# Altium project AVR Development Main board.PrjPcb
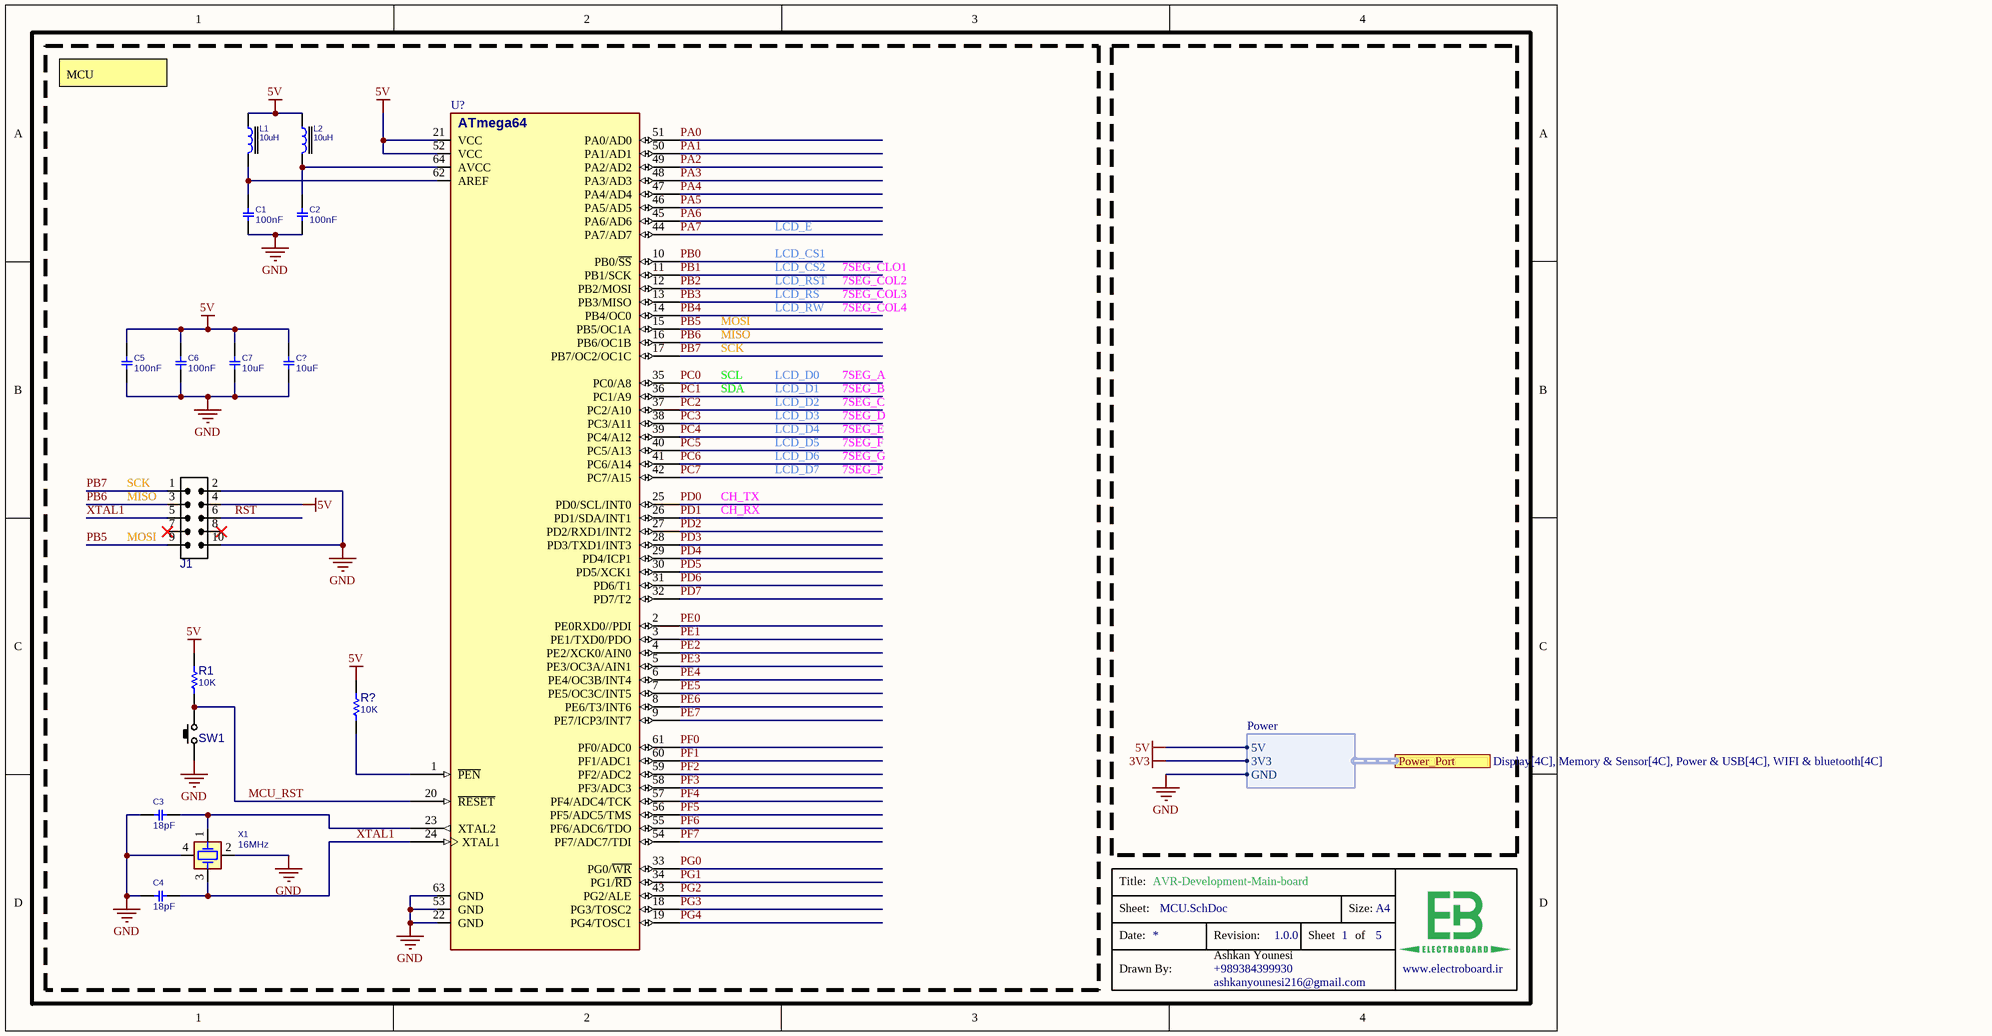
[diagram p0: MCU.SchDoc]
Revision: 1.0.0; Title: AVR-Development-Main-board
5 sheets, 172 parts. Net scope: flat (ports and power ports of the same name join across sheets).
Sheets:
  MCU.SchDoc
  Memory & Sensor.SchDoc
  WIFI & bluetooth.SchDoc
  Display.SchDoc
  Power & USB.SchDoc

## Sheet MCU.SchDoc: AVR-Development-Main-board
size A4; SheetNumber: 1; SheetTotal: 5

### Parts
(Parts that share a designator on the sheet are numbered #1, #2 ... from top to bottom, then left to right.)
C1  100nF  [C0805]
C2  100nF  [C0805]
C3  18pF  [C0805]
C4  18pF  [C0805]
C5  100nF  [C0805]
C6  100nF  [C0805]
C7  10uF  [C0805]
C?#1  10uF  [C0805]
J1  IDC_2X5  [IDC_2X5]  (value not drawn)
L1  10uH  [L0805]
L2  10uH  [L0805]
R1  10K  [R0805]
R?#1  10K  [R0805]
SW1  PUSHBUTTON  [SWPBS_SPST_6X3X5]  (value not drawn)
U?#1  ATMEGA64  [QFG80_64]  (value not drawn)
X1  16MHz  [XTL_4_3225]

### Ports
Power_Port (harness POWER, see Display[4C], Memory & Sensor[4C], Power & USB[4C], WIFI & bluetooth[4C])

### Harnesses
Power: 5V, 3V3, GND

### Nets
5V: C5.2 C6.2 C7.2 C?#1.2 J1.4 L1.1 L2.1 R1.1 R?#1.1 U?#1.21(VCC) U?#1.52(VCC) ; port Power_Port.5V
GND: C1.1 C2.1 C3.2 C4.1 C5.1 C6.1 C7.1 C?#1.1 J1.2 J1.10 SW1.1(P1) U?#1.22(GND) U?#1.53(GND) U?#1.63(GND) X1.2 X1.4 ; port Power_Port.GND
MCU_RST: R1.2 SW1.2(P3) U?#1.20(~{RESET})
PA0: U?#1.51(PA0/AD0)
PA1: U?#1.50(PA1/AD1)
PA2: U?#1.49(PA2/AD2)
PA3: U?#1.48(PA3/AD3)
PA4: U?#1.47(PA4/AD4)
PA5: U?#1.46(PA5/AD5)
PA6: U?#1.45(PA6/AD6)
PA7: U?#1.44(PA7/AD7)
PB0: U?#1.10(PB0/~{SS})
PB1: U?#1.11(PB1/SCK)
PB2: U?#1.12(PB2/MOSI)
PB3: U?#1.13(PB3/MISO)
PB4: U?#1.14(PB4/OC0)
PB5: J1.9 U?#1.15(PB5/OC1A)
PB6: J1.3 U?#1.16(PB6/OC1B)
PB7: J1.1 U?#1.17(PB7/OC2/OC1C)
PC0: U?#1.35(PC0/A8)
PC1: U?#1.36(PC1/A9)
PC2: U?#1.37(PC2/A10)
PC3: U?#1.38(PC3/A11)
PC4: U?#1.39(PC4/A12)
PC5: U?#1.40(PC5/A13)
PC6: U?#1.41(PC6/A14)
PC7: U?#1.42(PC7/A15)
PD0: U?#1.25(PD0/SCL/INT0)
PD1: U?#1.26(PD1/SDA/INT1)
PD2: U?#1.27(PD2/RXD1/INT2)
PD3: U?#1.28(PD3/TXD1/INT3)
PD4: U?#1.29(PD4/ICP1)
PD5: U?#1.30(PD5/XCK1)
PD6: U?#1.31(PD6/T1)
PD7: U?#1.32(PD7/T2)
PE0: U?#1.2(PE0RXD0//PDI)
PE1: U?#1.3(PE1/TXD0/PDO)
PE2: U?#1.4(PE2/XCK0/AIN0)
PE3: U?#1.5(PE3/OC3A/AIN1)
PE4: U?#1.6(PE4/OC3B/INT4)
PE5: U?#1.7(PE5/OC3C/INT5)
PE6: U?#1.8(PE6/T3/INT6)
PE7: U?#1.9(PE7/ICP3/INT7)
PF0: U?#1.61(PF0/ADC0)
PF1: U?#1.60(PF1/ADC1)
PF2: U?#1.59(PF2/ADC2)
PF3: U?#1.58(PF3/ADC3)
PF4: U?#1.57(PF4/ADC4/TCK)
PF5: U?#1.56(PF5/ADC5/TMS)
PF6: U?#1.55(PF6/ADC6/TDO)
PF7: U?#1.54(PF7/ADC7/TDI)
PG0: U?#1.33(PG0/~{WR})
PG1: U?#1.34(PG1/~{RD})
PG2: U?#1.43(PG2/ALE)
PG3: U?#1.18(PG3/TOSC2)
PG4: U?#1.19(PG4/TOSC1)
RST: J1.6
XTAL1: C4.2 J1.5 U?#1.24(XTAL1) X1.3
NetC1_2: C1.2 L1.2 U?#1.62(AREF)
NetC2_2: C2.2 L2.2 U?#1.64(AVCC)
NetC3_1: C3.1 U?#1.23(XTAL2) X1.1
NetR?#1_2: R?#1.2 U?#1.1(~{PEN})

Not connected (* = marked no-connect by the designer): J1 7* 8*

### Notes on the sheet
- MCU
- LCD_E
- LCD_RW
- LCD_RS
- LCD_RST
- LCD_CS2
- LCD_CS1
- 7SEG_CLO1
- 7SEG_COL2
- 7SEG_COL3
- 7SEG_COL4
- SCK
- MISO
- MOSI
- SCL
- LCD_D0
- 7SEG_A
- SDA
- LCD_D5
- LCD_D4
- LCD_D3
- LCD_D2
- LCD_D1
- 7SEG_B
- 7SEG_C
- 7SEG_D
- 7SEG_E
- 7SEG_F
- (near J1) SCK
- (near J1) MISO
- CH_TX
- CH_RX
- LCD_D7
- LCD_D6
- 7SEG_G
- 7SEG_P
- (near J1) MOSI
- Title:
- Sheet:
- Size:
- A4
- Drawn By:
- Date:
- Revision:
- Ashkan Younesi
- ashkanyounesi216@gmail.com
- +989384399930
- Sheet
- of
- www.electroboard.ir <http://www.electroboard.ir>
- (in symbol ATMEGA64A_QFP64) ATmega64

### Library data of the parts
C1-C7 C?#1 = CAP_SMD_MLCC_0805: CAP, MLCC; PARAM: -, -%; MANF_P#: MANF_PART#; PARAM2: -V; PRICE: 100= 1$; MANF: -; ASSEMBLY: ASSEMBLY
  C1 C2 C5 C6: VALUE: 100nF
  C3 C4: VALUE: 18pF
  C7 C?#1: VALUE: 10uF
J1 = IDC_2X5: CONN, IDC, Male, pitch: 2.54mm, 10POS; VALUE: IDC_2X5
L1 L2 = IND_SMD_470nH_3.2A: INDUCTOR, 470nH, 3.2A (Irms), 36mOhm; PARAM: 3.2A (Irms), -55~155oC; MANF: Taiyo Yuden; PARAM2: 36mOhm, 0.8mm Height; MANF_P#: MCHK2012TR47M; PRICE: 0.25$; ASSEMBLY: ASSEMBLY; VALUE: 10uH
R1 R?#1 = RES_SMD_0805: RESISTOR, SMD; PARAM: -W; DESC: DESCRIPTION; DIST#: MOUSER; PARAM2: 1%; MANF_P#: -; MANF: -; ASSEMBLY: ASSEMBLY; PRICE: 100= 0.5$; VALUE: 10K
SW1 = SWPBS_SPST_6X3X5: SWITCH, PUSH BUTTON, TACTILE, SMD, SPST, 6X3.5X5mm; MANF: ALPS; DESC: DESCRIPTION; MANF_P#: SKQMBBE010; VALUE: PUSHBUTTON; ASSEMBLY: ASSEMBLY; PARAM: PARAM; PRICE: PRICE
U?#1 = ATMEGA64A_QFP64: MCU, AVR, 8-Bit, 64KB, 4KB RAM, 16MHz; MANF_P#: ATMEGA64A-AU; DESC: 2KB EEPROM; MANF: ATMEL/MICROCHIP; PARAM2: 2.7~5.5V; PARAM: 64KB, 4KB RAM, 16MHz, -40~85°C; PRICE: 4.5$; VALUE: ATMEGA64
X1 = XTL_4_12MHz_3225: Crystal 12MHz; MANF: ECS; MANF_P#: ECS-120-18-33-JEM-TR; PARAM: 20PPM, 18pF; PRICE: 0.5$; VALUE: 16MHz

## Sheet Memory & Sensor.SchDoc: AVR-Development-Main-board
size A4; SheetNumber: 2; SheetTotal: 4
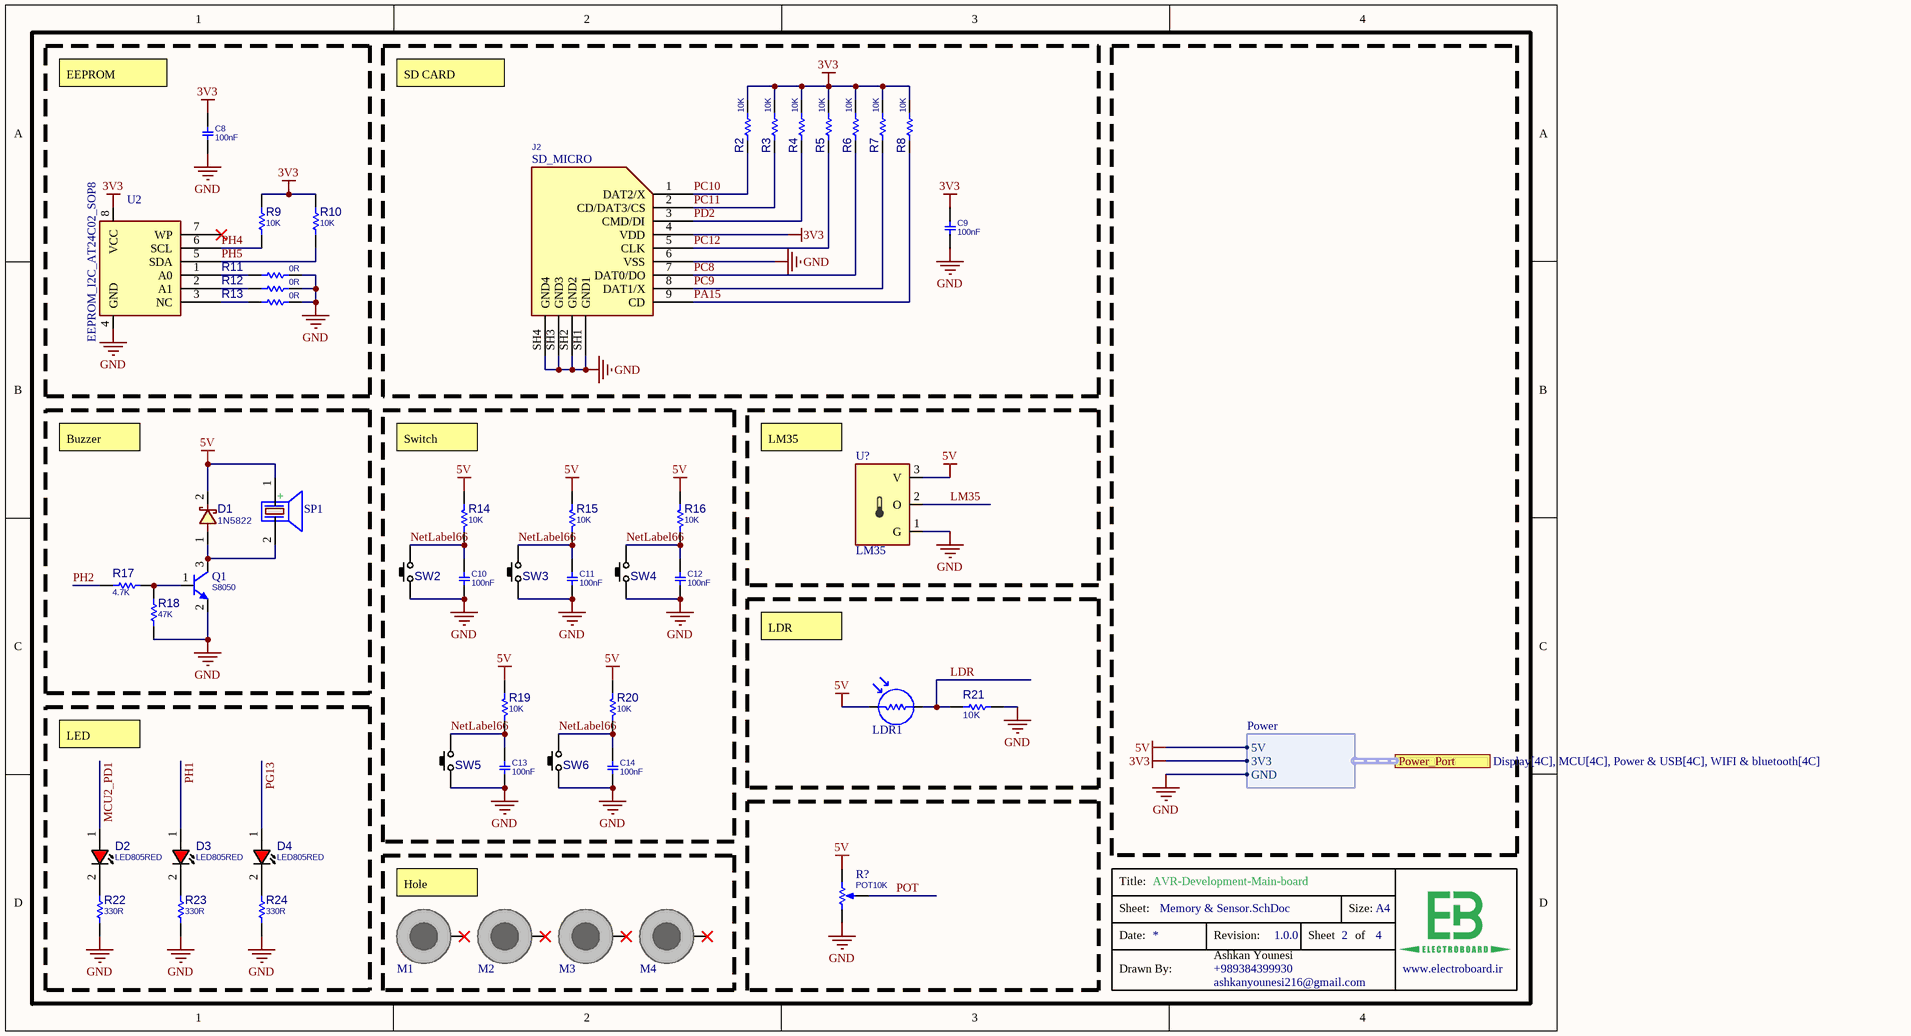
[diagram p1: Memory & Sensor.SchDoc]

### Parts
(Parts that share a designator on the sheet are numbered #1, #2 ... from top to bottom, then left to right.)
C8  100nF  [C0603]
C9  100nF  [C0603]
C10  100nF  [C0603]
C11  100nF  [C0603]
C12  100nF  [C0603]
C13  100nF  [C0603]
C14  100nF  [C0603]
D1  1N5822  [D_SMA]
D2  LED805RED  [LED0805RED]
D3  LED805RED  [LED0805RED]
D4  LED805RED  [LED0805RED]
J2  SD_MICRO  [SDMICRO_AT]
LDR1  PhotoCell  [PhotoCell]  (value not drawn)
M1  DNP/MH  [SCMH_M3F]  (value not drawn)  (no BOM)
M2  DNP/MH  [SCMH_M3F]  (value not drawn)  (no BOM)
M3  DNP/MH  [SCMH_M3F]  (value not drawn)  (no BOM)
M4  DNP/MH  [SCMH_M3F]  (value not drawn)  (no BOM)
Q1  S8050  [SOT23_3]
R2  10K  [R0603]
R3  10K  [R0603]
R4  10K  [R0603]
R5  10K  [R0603]
R6  10K  [R0603]
R7  10K  [R0603]
R8  10K  [R0603]
R9  10K  [R0603]
R10  10K  [R0603]
R11  0R  [R0603]
R12  0R  [R0603]
R13  0R  [R0603]
R14  10K  [R0603]
R15  10K  [R0603]
R16  10K  [R0603]
R17  4.7K  [R0603]
R18  47K  [R0603]
R19  10K  [R0603]
R20  10K  [R0603]
R21  10K  [R0805]
R22  330R  [R0603]
R23  330R  [R0603]
R24  330R  [R0603]
R?#2  POT10K  [POT_3296W]
SP1  (no value)  [BUZZER 7.62mm DC]
SW2  PUSHBUTTON  [SWPBS_SPST_6X3X5]  (value not drawn)
SW3  PUSHBUTTON  [SWPBS_SPST_6X3X5]  (value not drawn)
SW4  PUSHBUTTON  [SWPBS_SPST_6X3X5]  (value not drawn)
SW5  PUSHBUTTON  [SWPBS_SPST_6X3X5]  (value not drawn)
SW6  PUSHBUTTON  [SWPBS_SPST_6X3X5]  (value not drawn)
U2  EEPROM_I2C_AT24C02_SOP8  [SO_8]
U?#2  LM35  [TO92_3]

### Ports
Power_Port (harness POWER, see Display[4C], MCU[4C], Power & USB[4C], WIFI & bluetooth[4C])

### Harnesses
Power: 5V, 3V3, GND

### Nets
3V3: C8.2 C9.1 J2.4(VDD) R2.2 R3.2 R4.2 R5.2 R6.2 R7.2 R8.2 R9.2 R10.2 U2.8(VCC) ; port Power_Port.3V3
5V: D1.2 LDR1.1 R14.2 R15.2 R16.2 R19.2 R20.2 R?#2.3(BOT) SP1.1(+) U?#2.3(V) ; port Power_Port.5V
GND: C8.1 C9.2 C10.1 C11.1 C12.1 C13.1 C14.1 J2.6(VSS) J2.SH1(GND1) J2.SH2(GND2) J2.SH3(GND3) J2.SH4(GND4) Q1.2(E) R11.2 R12.2 R13.2 R18.1 R21.1 R22.1 R23.1 R24.1 R?#2.1(TOP) SW2.2(P3) SW3.2(P3) SW4.2(P3) SW5.2(P3) SW6.2(P3) U2.4(GND) U?#2.1(G) ; port Power_Port.GND
LDR: LDR1.2 R21.2
LM35: U?#2.2(O)
MCU2_PD1: D2.1(ANODE)
NetLabel66: C10.2 C11.2 C12.2 C13.2 C14.2 R14.1 R15.1 R16.1 R19.1 R20.1 SW2.1(P1) SW3.1(P1) SW4.1(P1) SW5.1(P1) SW6.1(P1)
PA15: J2.9(CD) R8.1
PC8: J2.7(DAT0/DO) R6.1
PC9: J2.8(DAT1/X) R7.1
PC10: J2.1(DAT2/X) R2.1
PC11: J2.2(CD/DAT3/CS) R3.1
PC12: J2.5(CLK) R5.1
PD2: J2.3(CMD/DI) R4.1
PG13: D4.1(ANODE)
PH1: D3.1(ANODE)
PH2: R17.2
PH4: R9.1 U2.6(SCL)
PH5: R10.1 U2.5(SDA)
POT: R?#2.2(TAP)
NetD1_1: D1.1 Q1.3(C) SP1.2(-)
NetD2_2: D2.2(CATHODE) R22.2
NetD3_2: D3.2(CATHODE) R23.2
NetD4_2: D4.2(CATHODE) R24.2
NetQ1_1: Q1.1(B) R17.1 R18.2
NetR11_1: R11.1 U2.1(A0)
NetR12_1: R12.1 U2.2(A1)
NetR13_1: R13.1 U2.3(NC)

Not connected (* = marked no-connect by the designer): M1 1*; M2 1*; M3 1*; M4 1*; U2 7(WP)*

### Notes on the sheet
- EEPROM
- SD CARD
- Buzzer
- Switch
- LM35
- LDR
- LED
- (near M1) Hole
- Title:
- Sheet:
- Size:
- A4
- Drawn By:
- Date:
- Revision:
- Ashkan Younesi
- ashkanyounesi216@gmail.com
- +989384399930
- Sheet
- of
- www.electroboard.ir <http://www.electroboard.ir>

### Library data of the parts
C8-C14 = CAP_SMD_MLCC: CAP, MLCC, 1nF, 50V, C0G, 10%, 0402; DESC: CAP, MLCC, 100nF, 50V, C0G, 10%, 0402; MANF_P#: MANF_PART#; MANF: Murata; PARAM: C0G, 10%; PRICE: 100= 1$; PARAM2: 50V; ASSEMBLY: ASSEMBLY; VALUE: 100nF
D1 = DIODE_SMD_SCHOTTKY_1N5822: DIODE, SCHOTTKY, 40V, 3A; MANF: DIODES; DESC: DESCRIPTION; MANF_P#: 1N5822; ASSEMBLY: ASSEMBLY; PRICE: PRICE; PARAM2: 3A; PARAM: 40V; VALUE: 1N5822
D2-D4 = LED_SMD_0805_RED: LED, SMD, 0805, RED; DESC: DESCRIPTION; MANF_P#: MANF_PART#; PARAM2: 2.2V; MANF: MANF; ASSEMBLY: ASSEMBLY; PRICE: 36t@Javan; VALUE: LED805RED
J2 = SOCKET_SDMICRO_AT: SD MICRO exist in Iran, Attend 112J-TDAR-R01; PARAM: push-push; MANF: Attend; MANF_P#: 112J-TDAR-R01; VALUE: SD_MICRO
LDR1 = LDR: Photo Cell- Variable Resistor With Light; Company: IPA CO.; Designer: Saeid Jorablo; Last Update Time: 2008/07/17
M1-M4 = SCMH_M3F: SCREW mouting, M3, 3.0mm diameter and 6.0mm FlangeHead; ASSEMBLY: DNP; VALUE: DNP/MH
Q1 = NPN_S8050_SOT23: BJT, NPN, 25v, 0.5A, SMD, SOT23; PARAM2: 300mW; PARAM: 25v, 0.5A; MANF_P#: S8050; MANF: -; VALUE: S8050
R2-R20 R22-R24 = RES_SMD: RESISTOR, SMD; PARAM: -W; DESC: DESCRIPTION; DIST#: MOUSER; PARAM2: 1%; MANF_P#: -; MANF: -; ASSEMBLY: ASSEMBLY; PRICE: 100= 0.5$
  R2-R10 R14-R16 R19 R20: VALUE: 10K
  R11-R13: VALUE: 0R
  R17: VALUE: 4.7K
  R18: VALUE: 47K
  R22-R24: VALUE: 330R
R21 = RES_SMD_0805: as R1 on sheet MCU; MANF_P#: -; MANF: -; ASSEMBLY: ASSEMBLY; PRICE: 100= 0.5$; VALUE: 10K
R?#2 = RES_THD_POT_MULTITURN: RESISTOR, THD, Potentiometer Multiturn, most Popular; VALUE: POT10K
SP1 = PIEZO BUZZER: PIEZO BUZZER ACTIVE; Designer: Abbas Basereh; Comment_1: SPEAKER AND BEEP; Design Date: 1395/11/14; ComponentLink2Description: Reference; PackageDescription: THD; Publisher: Abbas Basereh; Mounting Technology: THD; Pin Count: 2; Status: Unreleased
SW2-SW6 = SWPBS_SPST_6X3X5: as SW1 on sheet MCU; VALUE: PUSHBUTTON; ASSEMBLY: ASSEMBLY; PARAM: PARAM; PRICE: PRICE
U2 = EEPROM_I2C_AT24C02_SOP8: EEPROM, I2C; VALUE: AT24C02
U?#2 = TMP_LM35_TO92: SENSOR, TEMP, ANALOG, -55~150oC, 4~20Vcc, Out 0mV + 10mV/oC; MANF_P#: LM35CZ, LM35CAZ or LM35DZ; MANF: TI; PARAM: 0.5°C Accuracy, 10mV/oC, -55~150oC; PARAM2: 4~20Vcc; PRICE: 7$; VALUE: LM35

## Sheet WIFI & bluetooth.SchDoc: AVR-Development-Main-board
size A4; SheetNumber: 3; SheetTotal: 5
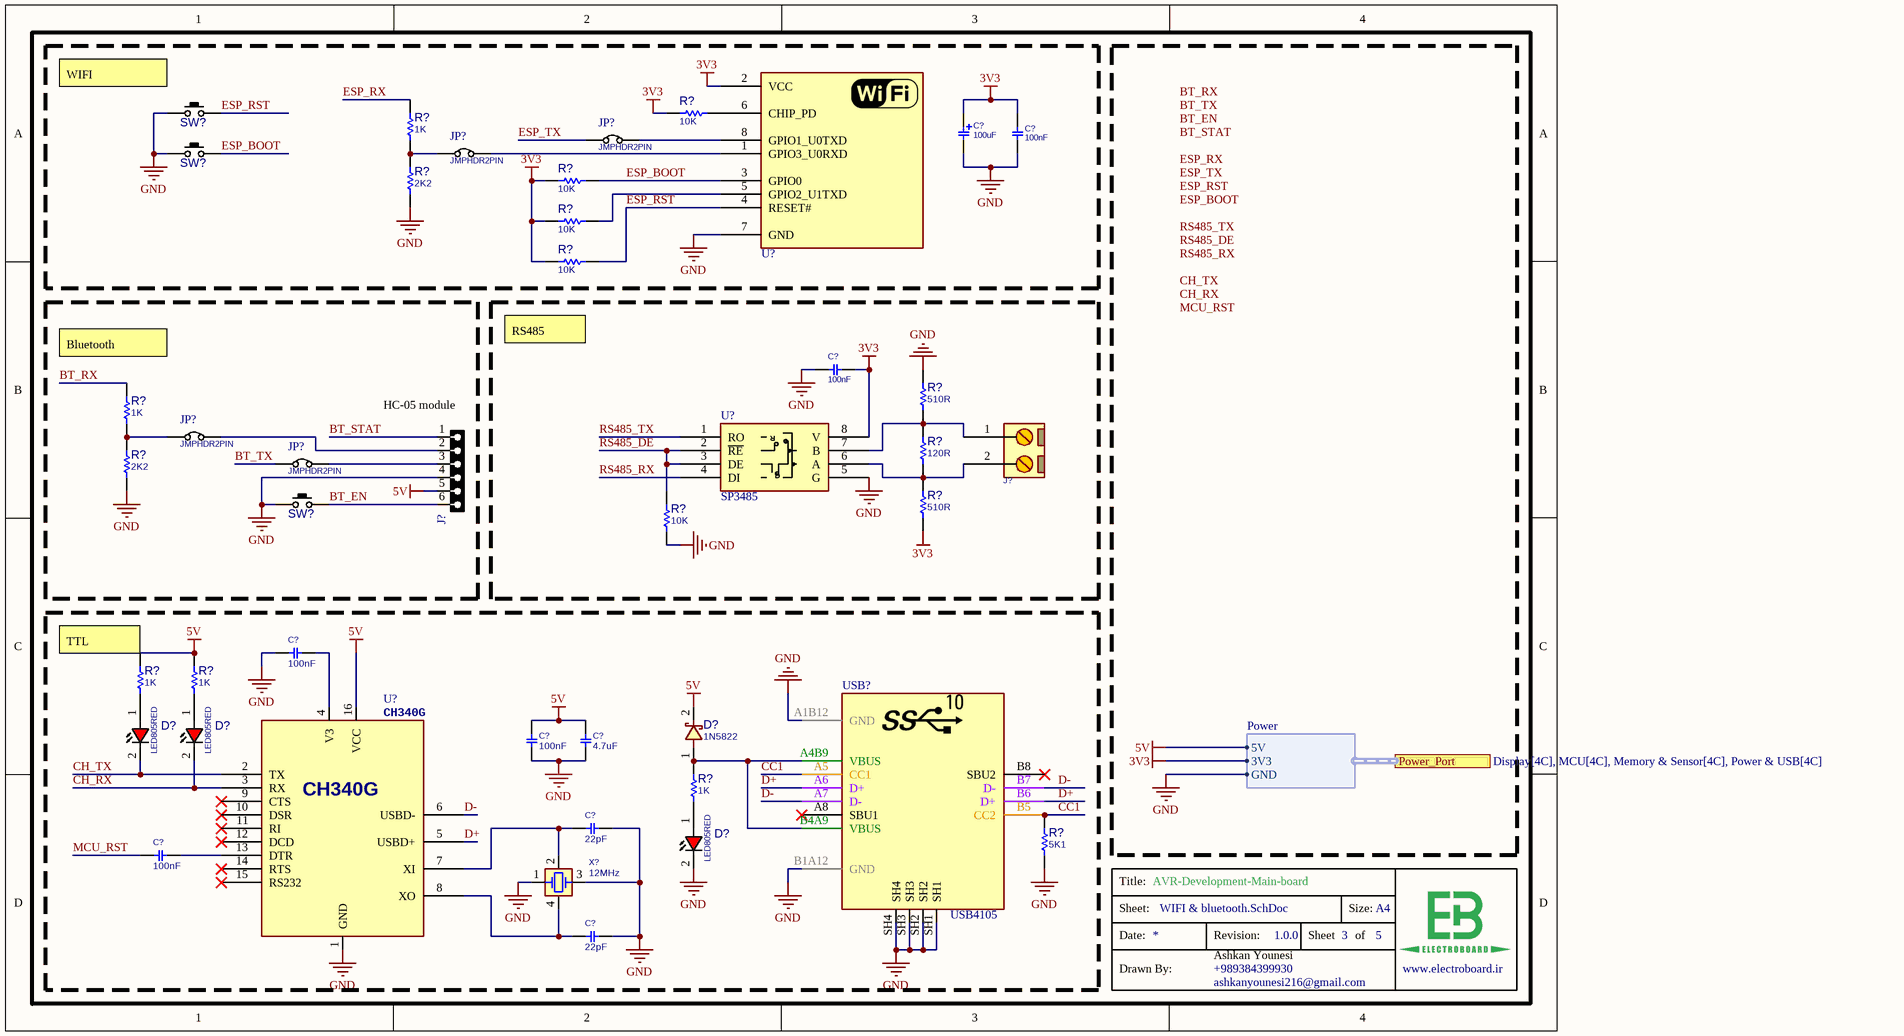
[diagram p2: WIFI & bluetooth.SchDoc]

### Parts
(Parts that share a designator on the sheet are numbered #1, #2 ... from top to bottom, then left to right.)
C?#2  100uF  [C_TN_3216]
C?#3  100nF  [C0603]
C?#4  100nF  [C0805]
C?#5  100nF  [C0805]
C?#6  100nF  [C0805]
C?#7  4.7uF  [C0805]
C?#8  22pF  [C0805]
C?#9  100nF  [C0805]
C?#10  22pF  [C0805]
D?#1  LED805RED  [LED0805RED]
D?#2  LED805RED  [LED0805RED]
D?#3  1N5822  [D_SMA]
D?#4  LED805RED  [LED0805RED]
J?#1  CONN_TB2  [MSTB_2]  (value not drawn)
J?#2  HDRF6  [HDR_F_1X6]  (value not drawn)
JP?#1  JMPHDR2PIN  [JP_2_BLK]
JP?#2  JMPHDR2PIN  [JP_2_BLK]
JP?#3  JMPHDR2PIN  [JP_2_BLK]
JP?#4  JMPHDR2PIN  [JP_2_BLK]
R?#3  10K  [R0805]
R?#4  1K  [R0805]
R?#5  2K2  [R0805]
R?#6  10K  [R0805]
R?#7  10K  [R0805]
R?#8  10K  [R0805]
R?#9  510R  [R0805]
R?#10  1K  [R0805]
R?#11  120R  [R0805]
R?#12  2K2  [R0805]
R?#13  510R  [R0805]
R?#14  10K  [R0805]
R?#15  1K  [R0805]
R?#16  1K  [R0805]
R?#17  1K  [R0805]
R?#18  5K1  [R0805]
SW?#1  PUSHBUTTON  [SWPBS_SPST_6X3X5]  (value not drawn)
SW?#2  PUSHBUTTON  [SWPBS_SPST_6X3X5]  (value not drawn)
SW?#3  PUSHBUTTON  [SWPBS_SPST_6X3X5]  (value not drawn)
U?#3  ESP-01  [ESP8266_ESP01]  (value not drawn)
U?#4  SP3485  [SO_8]
U?#5  CH340G  [SO_16]
USB?  USB4105  [USBC_SMD_16_USB4105]
X?  12MHz  [XTL_4_3225]

### Ports
Power_Port (harness POWER, see Display[4C], MCU[4C], Memory & Sensor[4C], Power & USB[4C])

### Harnesses
Power: 5V, 3V3, GND

### Nets
3V3: C?#2.1 C?#3.2 C?#4.1 R?#3.1 R?#6.1 R?#7.1 R?#8.1 R?#13.2 U?#3.2(VCC) U?#4.8(V) ; port Power_Port.3V3
5V: C?#6.2 C?#7.2 D?#3.2 J?#2.5 R?#15.1 R?#16.1 U?#5.16(VCC) ; port Power_Port.5V
GND: C?#2.2 C?#3.1 C?#4.2 C?#5.2 C?#6.1 C?#7.1 C?#8.1 C?#10.1 D?#4.2(CATHODE) J?#2.4 R?#5.2 R?#9.1 R?#12.2 R?#14.2 R?#18.2 SW?#1.1(P1) SW?#2.1(P1) SW?#3.1(P1) U?#3.7(GND) U?#4.5(G) U?#5.1(GND) USB?.A1B12(GND) USB?.B1A12(GND) USB?.SH1 USB?.SH2 USB?.SH3 USB?.SH4 X?.1 X?.3 ; port Power_Port.GND
BT_EN: J?#2.6 SW?#3.2(P3)
BT_RX: R?#10.1
BT_STAT: J?#2.1
BT_TX: JP?#4.1
CC1: R?#18.1 USB?.A5(CC1) USB?.B5(CC2)
CH_RX: D?#2.2(CATHODE) U?#5.3(RX)
CH_TX: D?#1.2(CATHODE) U?#5.2(TX)
D+: U?#5.5(USBD+) USB?.A6(D+) USB?.B6(D+)
D-: U?#5.6(USBD-) USB?.A7(D-) USB?.B7(D-)
ESP_BOOT: R?#6.2 SW?#2.2(P3) U?#3.3(GPIO0)
ESP_RST: R?#8.2 SW?#1.2(P3) U?#3.4(RESET#)
ESP_RX: R?#4.1
ESP_TX: JP?#1.1
MCU_RST: C?#9.2
RS485_DE: R?#14.1 U?#4.2(~{RE}) U?#4.3(DE)
RS485_RX: U?#4.4(DI)
RS485_TX: U?#4.1(RO)
NetC?#5_1: C?#5.1 U?#5.4(V3)
NetC?#8_2: C?#8.2 U?#5.7(XI) X?.2
NetC?#9_1: C?#9.1 U?#5.13(DTR)
NetC?#10_2: C?#10.2 U?#5.8(XO) X?.4
NetD?#1_1: D?#1.1(ANODE) R?#15.2
NetD?#2_1: D?#2.1(ANODE) R?#16.2
NetD?#3_1: D?#3.1 R?#17.1 USB?.A4B9(VBUS) USB?.B4A9(VBUS)
NetD?#4_1: D?#4.1(ANODE) R?#17.2
NetJ?#1_1: J?#1.1 R?#9.2 R?#11.1 U?#4.7(B)
NetJ?#1_2: J?#1.2 R?#11.2 R?#13.1 U?#4.6(A)
NetJ?#2_2: J?#2.2 JP?#3.2
NetJ?#2_3: J?#2.3 JP?#4.2
NetJP?#1_2: JP?#1.2 U?#3.8(GPIO1_U0TXD)
NetJP?#2_1: JP?#2.1 R?#4.2 R?#5.1
NetJP?#2_2: JP?#2.2 U?#3.1(GPIO3_U0RXD)
NetJP?#3_1: JP?#3.1 R?#10.2 R?#12.1
NetR?#3_2: R?#3.2 U?#3.6(CHIP_PD)
NetR?#7_2: R?#7.2 U?#3.5(GPIO2_U1TXD)

Not connected (* = marked no-connect by the designer): U?#5 9(CTS)* 10(DSR)* 11(RI)* 12(DCD)* 14(RTS)* 15(RS232)*; USB? A8(SBU1)* B8(SBU2)*

### Notes on the sheet
- (near SW?#1) WIFI
- (near R?#10) Bluetooth
- RS485
- (near J?#2) HC-05 module
- (near R?#15) TTL
- Labels drawn without touching a wire or pin: BT_EN, BT_RX, BT_STAT, BT_TX, CH_RX, CH_TX, ESP_BOOT, ESP_RST, ESP_RX, ESP_TX, MCU_RST, RS485_DE, RS485_RX, RS485_TX
- Title:
- Sheet:
- Size:
- A4
- Drawn By:
- Date:
- Revision:
- Ashkan Younesi
- ashkanyounesi216@gmail.com
- +989384399930
- Sheet
- of
- www.electroboard.ir <http://www.electroboard.ir>
- (in symbol SP3485_SOP8) R; D

### Library data of the parts
C?#2 = CAP_SMD_TAN_10uF_10V: CAP, SMD, TAN; PARAM: 20%, 300mOhm, -55~105oC; MANF: VISHAY; MANF_P#: T55A106M010C0300; PARAM2: 10V; PRICE: 0.46$; VALUE: 100uF
C?#3 = CAP_SMD_MLCC: as C8 on sheet Memory & Sensor; PARAM: C0G, 10%; PRICE: 100= 1$; PARAM2: 50V; ASSEMBLY: ASSEMBLY; VALUE: 100nF
C?#4 = CAP_SMD_MLCC_0805: CAP, MLCC, -F, -V, MATERIAL, -%, 0201; PARAM: -, -%; MANF_P#: MANF_PART#; PRICE: 100= 1$; MANF: -; PARAM2: -V; ASSEMBLY: ASSEMBLY; VALUE: 100nF
C?#5-C?#10 = CAP_SMD_MLCC: CAP, MLCC; PARAM: C0G, 10%; DESC: CAP, MLCC, 1nF, 50V, C0G, 10%, 0402; MANF_P#: MANF_PART#; MANF: Murata; PARAM2: 50V; PRICE: 100= 1$; ASSEMBLY: ASSEMBLY
  C?#5 C?#6 C?#9: VALUE: 100nF
  C?#7: VALUE: 4.7uF
  C?#8 C?#10: VALUE: 22pF
D?#1 D?#2 D?#4 = LED_SMD_0805_RED: as D2 on sheet Memory & Sensor; MANF: MANF; ASSEMBLY: ASSEMBLY; PRICE: 36t@Javan; VALUE: LED805RED
D?#3 = DIODE_SMD_SCHOTTKY_1N5822: as D1 on sheet Memory & Sensor; MANF_P#: 1N5822; ASSEMBLY: ASSEMBLY; PRICE: PRICE; PARAM2: 3A; PARAM: 40V; VALUE: 1N5822
J?#1 = CONN_MSTB_2: CONN, PHOENIX MSTB, 5-G, 5.08mm pitch; PARAM2: 320V; PARAM: 12A; VALUE: CONN_TB2
J?#2 = HDR_F_1X6: CONN, HEADER, Female, pitch: 2.54mm, 6POS; VALUE: HDRF6
JP?#1-JP?#4 = JUMPER_HDR_2P: JUMPER, HEADER 2PIN; MANF: MANF; MANF_P#: MANF_P#; VALUE: JMPHDR2PIN
R?#3-R?#8 R?#10 R?#12 R?#15-R?#18 = RES_SMD_0805: as R1 on sheet MCU; MANF_P#: -; MANF: -; ASSEMBLY: ASSEMBLY; PRICE: 100= 0.5$
  R?#3 R?#6-R?#8: VALUE: 10K
  R?#4 R?#10 R?#15-R?#17: VALUE: 1K
  R?#5 R?#12: VALUE: 2K2
  R?#18: VALUE: 5K1
R?#9 R?#11 R?#13 R?#14 = RES_SMD: as R2 on sheet Memory & Sensor; MANF_P#: -; MANF: -; ASSEMBLY: ASSEMBLY; PRICE: 100= 0.5$
  R?#9 R?#13: VALUE: 510R
  R?#11: VALUE: 120R
  R?#14: VALUE: 10K
SW?#1-SW?#3 = SWPBS_SPST_6X3X5: as SW1 on sheet MCU; VALUE: PUSHBUTTON; ASSEMBLY: ASSEMBLY; PARAM: PARAM; PRICE: PRICE
U?#3 = ESP8266_ESP-01: ESP8266 ESP-01 WiFi Module; MANF_P#: ESP-01; VALUE: ESP-01
U?#4 = SP3485_SOP8: RS-485 Transceiver, 3.3V; MANF: Exar; MANF_P#: SP3485; PRICE: 2.5$@MOUSER; VALUE: SP3485
U?#5 = CH340G_SOP16: USB-UART; MANF_P#: CH340G; VALUE: CH340G
USB? = CONN_USBC_SMD_16_USB4105: CONN, USB, Type C, USB 2.0, Right-Angle, SMD; MANF: GCT; MANF_P#: USB4105-GF-A; PARAM: 5A; Price: 1.5$; Value: USB4105
X? = XTL_4_12MHz_3225: as X1 on sheet MCU; PRICE: 0.5$; VALUE: 12MHz

## Sheet Display.SchDoc: AVR-Development-Main-board
size A4; SheetNumber: 4; SheetTotal: 4
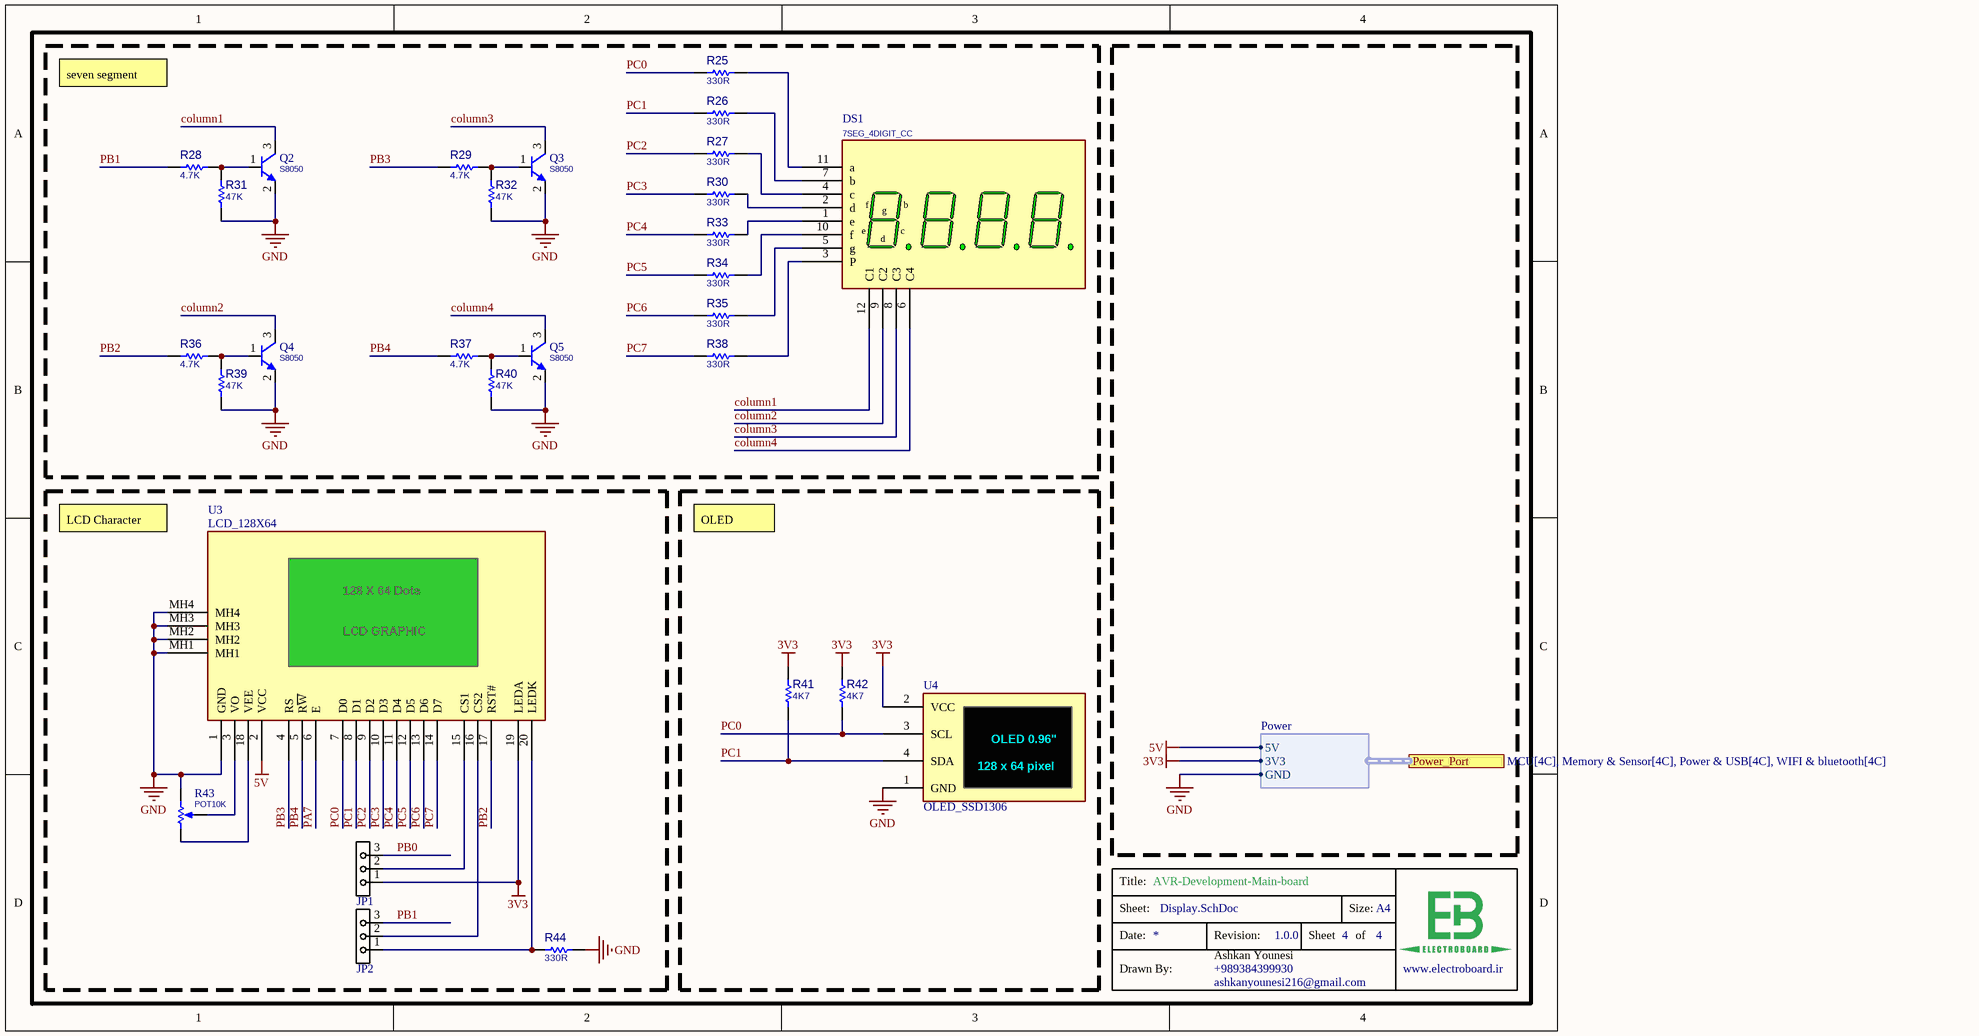
[diagram p3: Display.SchDoc]

### Parts
DS1  7SEG_4DIGIT_CC  [7SEGX4_12]
JP1  JMPHDR3PIN  [JP_3]  (value not drawn)
JP2  JMPHDR3PIN  [JP_3]  (value not drawn)
Q2  S8050  [SOT23_3]
Q3  S8050  [SOT23_3]
Q4  S8050  [SOT23_3]
Q5  S8050  [SOT23_3]
R25  330R  [R0805]
R26  330R  [R0805]
R27  330R  [R0805]
R28  4.7K  [R0805]
R29  4.7K  [R0805]
R30  330R  [R0805]
R31  47K  [R0805]
R32  47K  [R0805]
R33  330R  [R0805]
R34  330R  [R0805]
R35  330R  [R0805]
R36  4.7K  [R0805]
R37  4.7K  [R0805]
R38  330R  [R0805]
R39  47K  [R0805]
R40  47K  [R0805]
R41  4K7  [R0805]
R42  4K7  [R0805]
R43  POT10K  [POT_3296W]
R44  330R  [R0805]
U3  LCD_128X64  [LCDG_128X64_GRN]
U4  OLED_SSD1306  [OLED_SSD1306_64_I2C]

### Ports
Power_Port (harness POWER, see MCU[4C], Memory & Sensor[4C], Power & USB[4C], WIFI & bluetooth[4C])

### Harnesses
Power: 5V, 3V3, GND

### Nets
3V3: JP1.1 R41.1 R42.1 U3.19(LEDA) U4.2(VCC) ; port Power_Port.3V3
5V: U3.2(VCC) ; port Power_Port.5V
GND: Q2.2(E) Q3.2(E) Q4.2(E) Q5.2(E) R31.1 R32.1 R39.1 R40.1 R43.3(BOT) R44.1 U3.1(GND) U3.MH1 U3.MH2 U3.MH3 U3.MH4 U4.1(GND) ; port Power_Port.GND
column1: DS1.12(C1) Q2.3(C)
column2: DS1.9(C2) Q4.3(C)
column3: DS1.8(C3) Q3.3(C)
column4: DS1.6(C4) Q5.3(C)
PA7: U3.6(E)
PB0: JP1.3
PB1: JP2.3 R28.1
PB2: R36.1 U3.17(RST#)
PB3: R29.1 U3.4(RS)
PB4: R37.1 U3.5(R~{W})
PC0: R25.1 R42.2 U3.7(D0) U4.3(SCL)
PC1: R26.1 R41.2 U3.8(D1) U4.4(SDA)
PC2: R27.1 U3.9(D2)
PC3: R30.1 U3.10(D3)
PC4: R33.1 U3.11(D4)
PC5: R34.1 U3.12(D5)
PC6: R35.1 U3.13(D6)
PC7: R38.1 U3.14(D7)
NetDS1_1: DS1.1(e) R33.2
NetDS1_2: DS1.2(d) R30.2
NetDS1_3: DS1.3(P) R38.2
NetDS1_4: DS1.4(c) R27.2
NetDS1_5: DS1.5(g) R35.2
NetDS1_7: DS1.7(b) R26.2
NetDS1_10: DS1.10(f) R34.2
NetDS1_11: DS1.11(a) R25.2
NetJP1_2: JP1.2 U3.15(CS1)
NetJP2_1: JP2.1 R44.2 U3.20(LEDK)
NetJP2_2: JP2.2 U3.16(CS2)
NetQ2_1: Q2.1(B) R28.2 R31.2
NetQ3_1: Q3.1(B) R29.2 R32.2
NetQ4_1: Q4.1(B) R36.2 R39.2
NetQ5_1: Q5.1(B) R37.2 R40.2
NetR43_1: R43.1(TOP) U3.18(VEE)
NetR43_2: R43.2(TAP) U3.3(VO)

### Notes on the sheet
- seven segment
- LCD Character
- OLED
- Title:
- Sheet:
- Size:
- A4
- Drawn By:
- Date:
- Revision:
- Ashkan Younesi
- ashkanyounesi216@gmail.com
- +989384399930
- Sheet
- of
- www.electroboard.ir <http://www.electroboard.ir>
- (in symbol LCDG_128X64_GRN) 128 X 64 Dots; LCD GRAPHIC
- (in symbol OLED_SSD1306_64_I2C) OLED 0.96"; 128 x 64 pixel

### Library data of the parts
DS1 = 7SEG_4DIGIT_CC: 7SEGMENT, 4DIGIT, common cathode 5641; MANF_P#: DPY-4CK; VALUE: 7SEG_4DIGIT_CC
JP1 JP2 = JUMPER_HDR_3P: JUMPER, HEADER 3PIN; MANF: MANF; MANF_P#: MANF_P#; VALUE: JMPHDR3PIN
Q2-Q5 = NPN_S8050_SOT23: as Q1 on sheet Memory & Sensor; PARAM: 25v, 0.5A; MANF_P#: S8050; MANF: -; VALUE: S8050
R25-R42 R44 = RES_SMD_0805: as R1 on sheet MCU; MANF_P#: -; MANF: -; ASSEMBLY: ASSEMBLY; PRICE: 100= 0.5$
  R25-R27 R30 R33-R35 R38 R44: VALUE: 330R
  R28 R29 R36 R37: VALUE: 4.7K
  R31 R32 R39 R40: VALUE: 47K
  R41 R42: VALUE: 4K7
R43 = RES_THD_POT_MULTITURN: as R?#2 on sheet Memory & Sensor; VALUE: POT10K
U3 = LCDG_128X64_GRN: LCD Graphic Disp, 128X64, with KS108 Controller; MANF: Winstar; MANF_P#: TS12864A-2, WG12864A-1; PARAM2: Green back, Gray, 5V; PARAM: 128X64 Dots, 2.9"; VALUE: LCD_128X64
U4 = OLED_SSD1306_64_I2C: OLED, SSD1306, 0.96", 128X64, BREAKOUT I2C; MANF_P#: OLED_SSD1306_I2C; PARAM2: 3.3/5VCC, -20~70oC; PARAM: 2 Colors, 0.96", 128X64; MANF: -; VALUE: OLED_SSD1306

## Sheet Power & USB.SchDoc: AVR-Development-Main-board
size A4; SheetNumber: 5; SheetTotal: 5
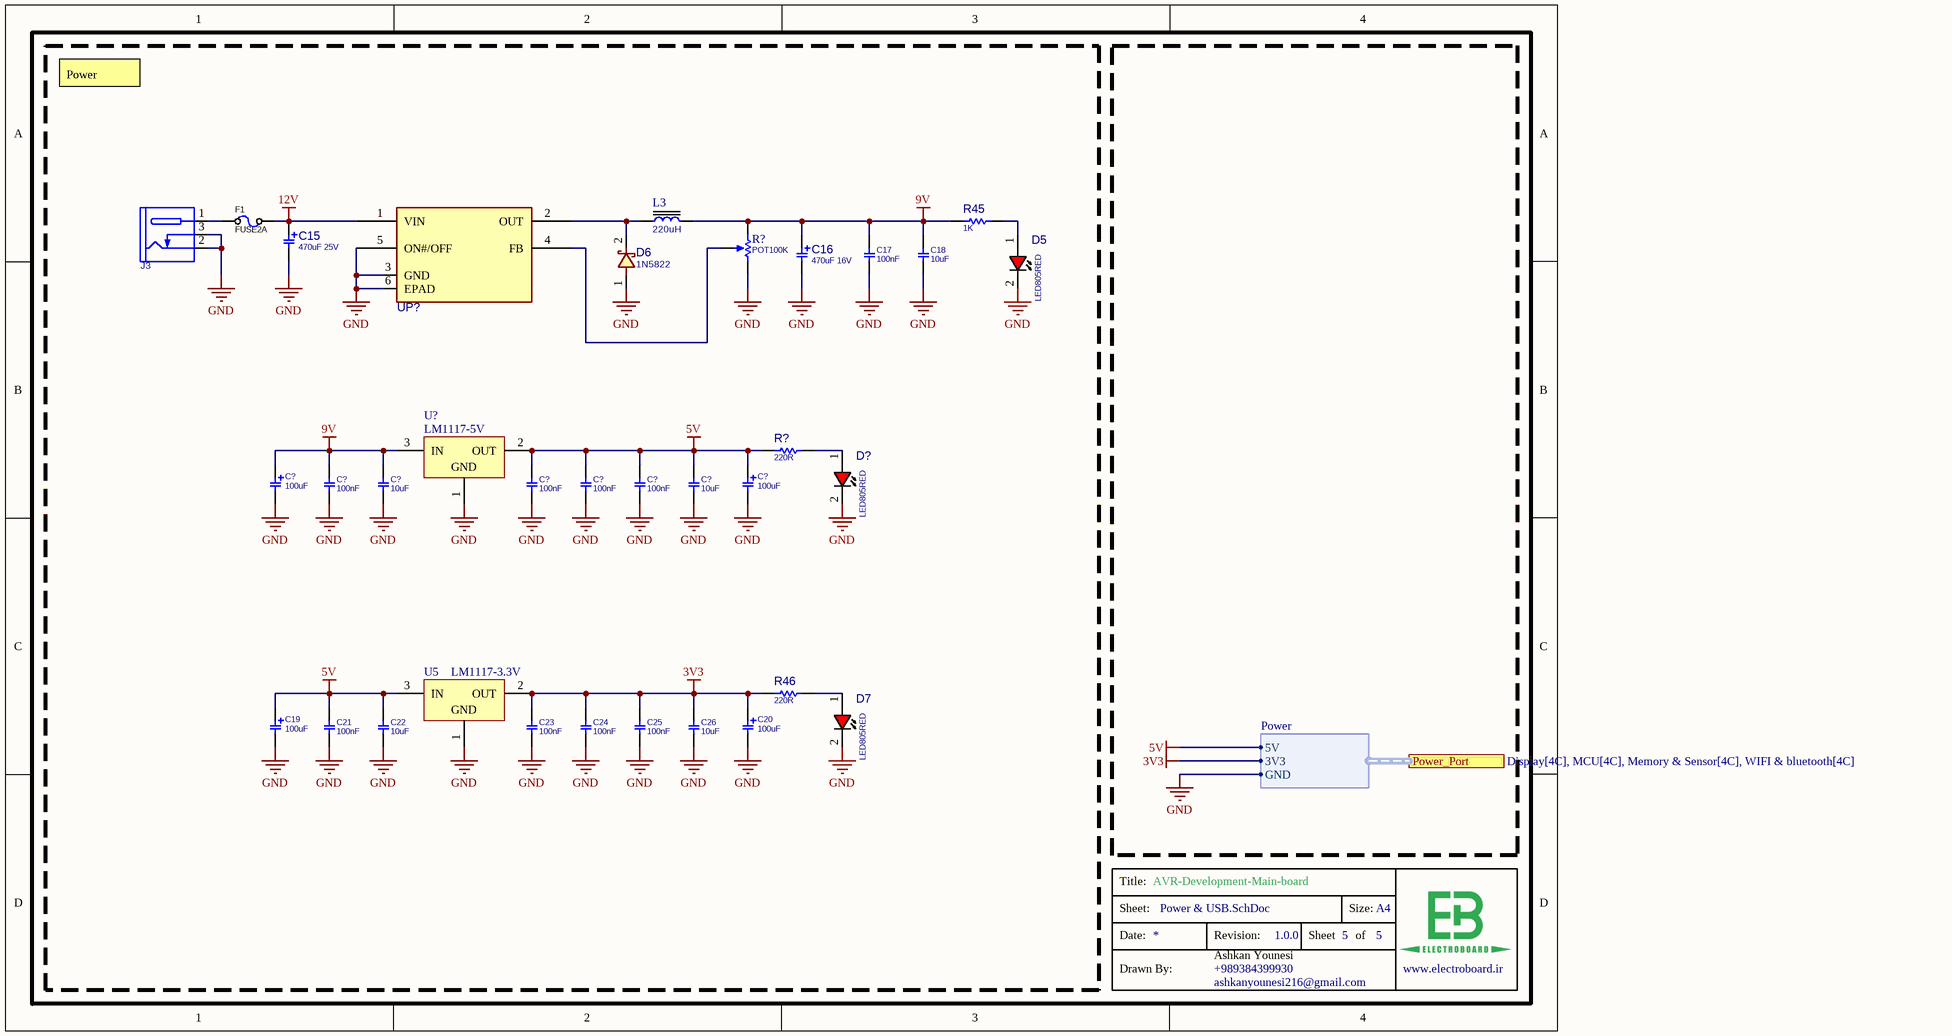
[diagram p4: Power & USB.SchDoc]

### Parts
(Parts that share a designator on the sheet are numbered #1, #2 ... from top to bottom, then left to right.)
C15  470uF 25V  [C_EL_8]
C16  470uF 16V  [C_EL_8]
C17  100nF  [C0603]
C18  10uF  [C0603]
C19  100uF  [C_TN_3216]
C20  100uF  [C_TN_3216]
C21  100nF  [C0805]
C22  10uF  [C0805]
C23  100nF  [C0805]
C24  100nF  [C0805]
C25  100nF  [C0805]
C26  10uF  [C0805]
C?#11  100uF  [C_TN_3216]
C?#12  100uF  [C_TN_3216]
C?#13  100nF  [C0805]
C?#14  10uF  [C0805]
C?#15  100nF  [C0805]
C?#16  100nF  [C0805]
C?#17  100nF  [C0805]
C?#18  10uF  [C0805]
D5  LED805RED  [LED0805RED]
D6  1N5822  [D_SMA]
D7  LED805RED  [LED0805RED]
D?#5  LED805RED  [LED0805RED]
F1  FUSE2A  [F2920]
J3  DC_POWER_JACK  [JAC_PWR2]  (value not drawn)
L3  220uH  [L_12]
R45  1K  [R0603]
R46  220R  [R0603]
R?#19  POT100K  [POT_3296W]
R?#20  220R  [R0603]
U5  LM1117-3.3V  [LM1117_SMD_SOT-223_3.3V]
U?#6  LM1117-5V  [LM1117_SMD_SOT-223_3.3V]
UP?  LM2576S-ADJ  [D2PAK_5]  (value not drawn)

### Ports
Power_Port (harness POWER, see Display[4C], MCU[4C], Memory & Sensor[4C], WIFI & bluetooth[4C])

### Harnesses
Power: 5V, 3V3, GND

### Nets
3V3: C20.1 C23.2 C24.2 C25.2 C26.2 R46.2 U5.2(OUT) ; port Power_Port.3V3
5V: C19.1 C21.2 C22.2 C?#12.1 C?#15.2 C?#16.2 C?#17.2 C?#18.2 R?#20.2 U5.3(IN) U?#6.2(OUT) ; port Power_Port.5V
9V: C16.1 C17.2 C18.2 C?#11.1 C?#13.2 C?#14.2 L3.2 R45.2 R?#19.1(TOP) U?#6.3(IN)
12V: C15.1 F1.2 UP?.1(VIN)
GND: C15.2 C16.2 C17.1 C18.1 C19.2 C20.2 C21.1 C22.1 C23.1 C24.1 C25.1 C26.1 C?#11.2 C?#12.2 C?#13.1 C?#14.1 C?#15.1 C?#16.1 C?#17.1 C?#18.1 D5.2(CATHODE) D6.1 D7.2(CATHODE) D?#5.2(CATHODE) J3.2(SLEEVE) J3.3(INSERTION_DET) R?#19.3(BOT) U5.1(GND) U?#6.1(GND) UP?.3(GND) UP?.5(ON#/OFF) UP?.6(EPAD) ; port Power_Port.GND
NetD5_1: D5.1(ANODE) R45.1
NetD6_2: D6.2 L3.1 UP?.2(OUT)
NetD7_1: D7.1(ANODE) R46.1
NetD?#5_1: D?#5.1(ANODE) R?#20.1
NetF1_1: F1.1 J3.1(TIP)
NetR?#19_2: R?#19.2(TAP) UP?.4(FB)

### Notes on the sheet
- Power
- Title:
- Sheet:
- Size:
- A4
- Drawn By:
- Date:
- Revision:
- Ashkan Younesi
- ashkanyounesi216@gmail.com
- +989384399930
- Sheet
- of
- www.electroboard.ir <http://www.electroboard.ir>

### Library data of the parts
C15 C16 = CAP_SMD_EL_330u25V: CAP, SMDD, ELEC, 330uF, 25V; MANF_P#: EEE-1EA331UP; PARAM2: 20%; MANF: PANASONIC; DESC: DESCRIPTION; DIST#: MOUSER; PRICE: 10= 5$; ASSEMBLY: ASSEMBLY; PARAM: 25V
  C15: VALUE: 470uF 25V
  C16: VALUE: 470uF 16V
C17 C18 = CAP_SMD_MLCC: as C8 on sheet Memory & Sensor; PARAM: C0G, 10%; PRICE: 100= 1$; PARAM2: 50V; ASSEMBLY: ASSEMBLY
  C17: VALUE: 100nF
  C18: VALUE: 10uF
C19 C20 C?#11 C?#12 = CAP_SMD_TAN_10uF_10V: as C?#2 on sheet WIFI & bluetooth; PRICE: 0.46$; VALUE: 100uF
C21-C26 C?#13-C?#18 = CAP_SMD_MLCC_0805: as C?#4 on sheet WIFI & bluetooth; PRICE: 100= 1$; MANF: -; PARAM2: -V; ASSEMBLY: ASSEMBLY
  C21 C23-C25 C?#13 C?#15-C?#17: VALUE: 100nF
  C22 C26 C?#14 C?#18: VALUE: 10uF
D5 D7 D?#5 = LED_SMD_0805_RED: as D2 on sheet Memory & Sensor; MANF: MANF; ASSEMBLY: ASSEMBLY; PRICE: 36t@Javan; VALUE: LED805RED
D6 = DIODE_SMD_SCHOTTKY_1N5822: as D1 on sheet Memory & Sensor; MANF_P#: 1N5822; ASSEMBLY: ASSEMBLY; PRICE: PRICE; PARAM2: 3A; PARAM: 40V; VALUE: 1N5822
F1 = FUSE_PPTC2A_2920: Fuse, PPTC, 2A, 24v, 120mOhm, 2920; PARAM: 2A, 4A Itrip, 100A max, -40~85oC; MANF: Bel Fuse; MANF_P#: 0ZCF0200AF2C; PARAM2: 24VDC, 120mOhm; DESC: Resettable Fuse; PRICE: 0.23$; VALUE: FUSE2A
J3 = CONN_PWR_JACKR2: CONN, PWR JACK DC, PLUG DIAM 2.0MM RA THD; MANF: CUI STACK; MANF_P#: PJ-202A, PJ-002AH, PJ-102AH, KLDX-0202; VALUE: DC_POWER_JACK
L3 = INDPWR_SMD: INDUCTOR, POWER, SMD; VALUE: 220uH
R45 R46 R?#20 = RES_SMD: as R2 on sheet Memory & Sensor; MANF_P#: -; MANF: -; ASSEMBLY: ASSEMBLY; PRICE: 100= 0.5$
  R45: VALUE: 1K
  R46 R?#20: VALUE: 220R
R?#19 = RES_THD_POT_MULTITURN: as R?#2 on sheet Memory & Sensor; VALUE: POT100K
U5 U?#6 = LM1117_SMD_SOT-223
UP? = VREG_LM2576S-ADJ_D2PAK: REG, Switching, Buck, 3A, ADJ, 50KHz, TO-220; MANF: TI, ON, HTC, MICROCHIP; PARAM: 3A, ADJ; PARAM2: 50KHz, 40VIN; ASSEMBLY: ASSEMBLY; PRICE: PRICE; DESC: REG, Switching, Buck, 3A, ADJ, 50KHz, TO-220; MANF_P#: LM2576S-ADJ; VALUE: LM2576S-ADJ; PACKAGE: D2PAK-5 (TO-263-5)

## Nets that join several sheets
3V3: Memory & Sensor (13 pins), WIFI & bluetooth (10 pins), Display (5 pins), Power & USB (7 pins)
5V: MCU (11 pins), Memory & Sensor (10 pins), WIFI & bluetooth (7 pins), Display (U3.2), Power & USB (11 pins)
GND: MCU (16 pins), Memory & Sensor (29 pins), WIFI & bluetooth (29 pins), Display (16 pins), Power & USB (32 pins)